# Altium schematic sheet ESCs_2S.SchDoc: Init Title in DocParam
size A3; Organization: Use Organization_Name in ProjParam; Address1: Daniel Burnier; Address2: STI-IMT-LSRO1; Address3: EPFL; Address4: CH-1015 LAUSANNE; DocumentNumber: Init DocumentNumber in DocParam; Revision: A; SheetNumber: 1; SheetTotal: 1; ApprovedBy: Init ApprovedBy in DocParam; CheckedBy: Init CheckedBy in DocParam; Author: Init Author in DocParam; CompanyName: Init CompanyName in DocParam; DrawnBy: Init DrawBy in DocParam; Engineer: Init Engineer in DocParam; Title2: Init Title2 in DocParam; DocumentName: Init DocumentName in DocParam; ProjectName: Init ProjectName in DocParam
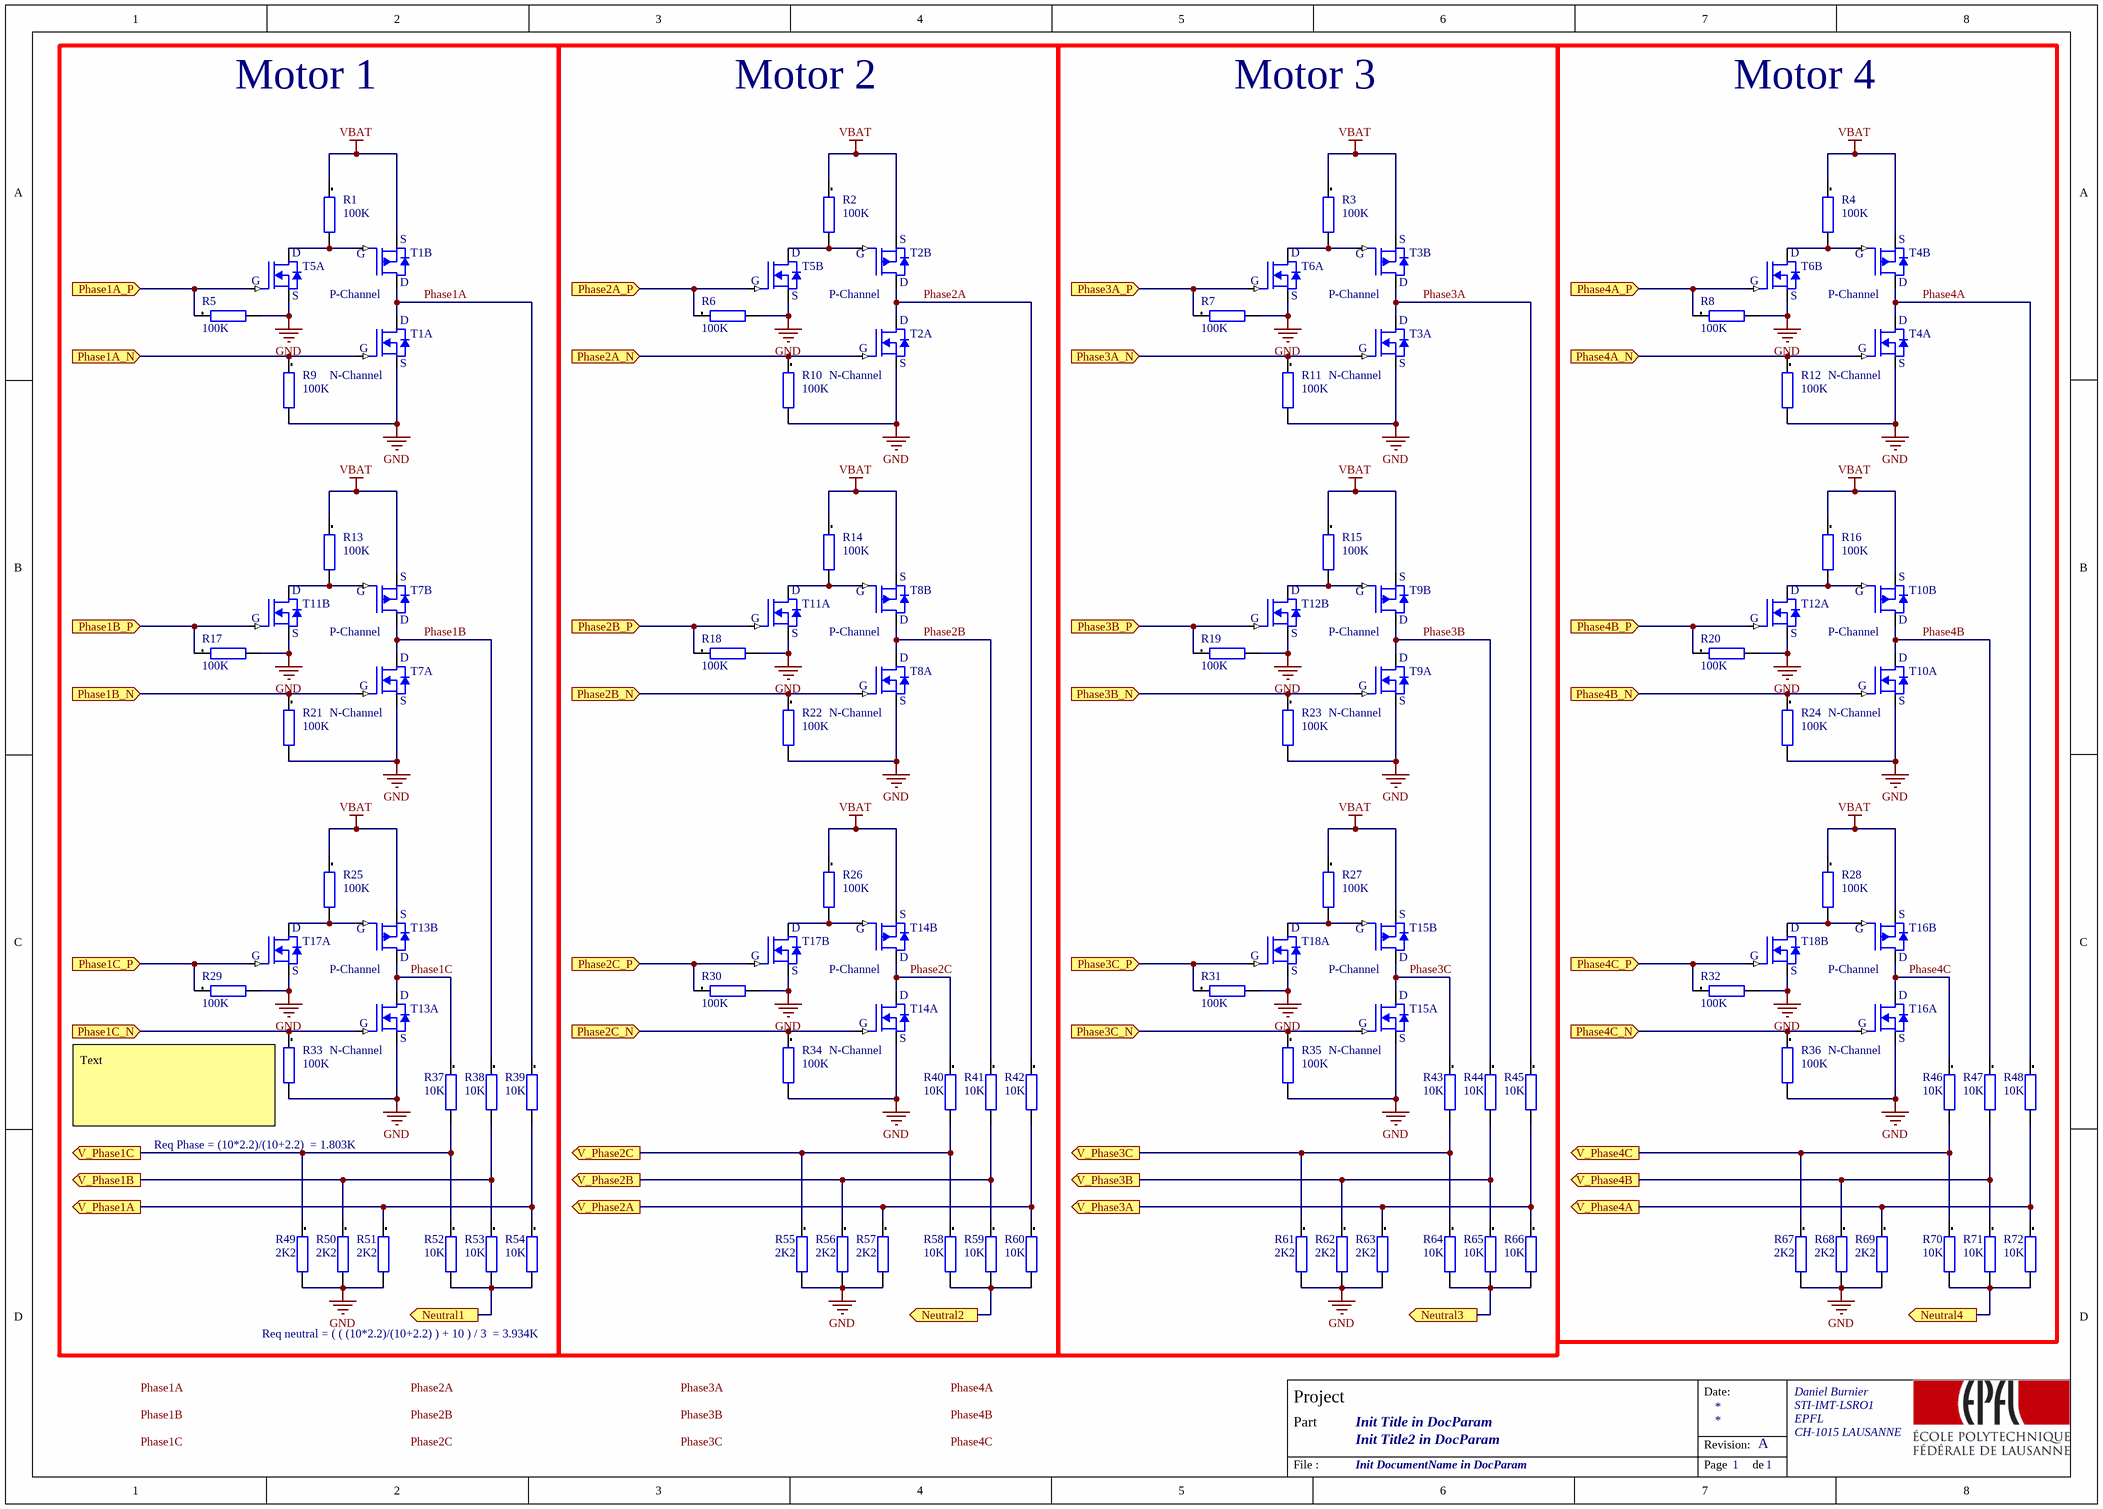
[diagram p0: ESCs_2S.SchDoc]

## Parts
R1  100K  [RESC0201(0603)_L]
R2  100K  [RESC0201(0603)_L]
R3  100K  [RESC0201(0603)_L]
R4  100K  [RESC0201(0603)_L]
R5  100K  [RESC0201(0603)_L]
R6  100K  [RESC0201(0603)_L]
R7  100K  [RESC0201(0603)_L]
R8  100K  [RESC0201(0603)_L]
R9  100K  [RESC0201(0603)_L]
R10  100K  [RESC0201(0603)_L]
R11  100K  [RESC0201(0603)_L]
R12  100K  [RESC0201(0603)_L]
R13  100K  [RESC0201(0603)_L]
R14  100K  [RESC0201(0603)_L]
R15  100K  [RESC0201(0603)_L]
R16  100K  [RESC0201(0603)_L]
R17  100K  [RESC0201(0603)_L]
R18  100K  [RESC0201(0603)_L]
R19  100K  [RESC0201(0603)_L]
R20  100K  [RESC0201(0603)_L]
R21  100K  [RESC0201(0603)_L]
R22  100K  [RESC0201(0603)_L]
R23  100K  [RESC0201(0603)_L]
R24  100K  [RESC0201(0603)_L]
R25  100K  [RESC0201(0603)_L]
R26  100K  [RESC0201(0603)_L]
R27  100K  [RESC0201(0603)_L]
R28  100K  [RESC0201(0603)_L]
R29  100K  [RESC0201(0603)_L]
R30  100K  [RESC0201(0603)_L]
R31  100K  [RESC0201(0603)_L]
R32  100K  [RESC0201(0603)_L]
R33  100K  [RESC0201(0603)_L]
R34  100K  [RESC0201(0603)_L]
R35  100K  [RESC0201(0603)_L]
R36  100K  [RESC0201(0603)_L]
R37  10K  [RESC0201(0603)_L]
R38  10K  [RESC0201(0603)_L]
R39  10K  [RESC0201(0603)_L]
R40  10K  [RESC0201(0603)_L]
R41  10K  [RESC0201(0603)_L]
R42  10K  [RESC0201(0603)_L]
R43  10K  [RESC0201(0603)_L]
R44  10K  [RESC0201(0603)_L]
R45  10K  [RESC0201(0603)_L]
R46  10K  [RESC0201(0603)_L]
R47  10K  [RESC0201(0603)_L]
R48  10K  [RESC0201(0603)_L]
R49  2K2  [RESC0201(0603)_L]
R50  2K2  [RESC0201(0603)_L]
R51  2K2  [RESC0201(0603)_L]
R52  10K  [RESC0201(0603)_L]
R53  10K  [RESC0201(0603)_L]
R54  10K  [RESC0201(0603)_L]
R55  2K2  [RESC0201(0603)_L]
R56  2K2  [RESC0201(0603)_L]
R57  2K2  [RESC0201(0603)_L]
R58  10K  [RESC0201(0603)_L]
R59  10K  [RESC0201(0603)_L]
R60  10K  [RESC0201(0603)_L]
R61  2K2  [RESC0201(0603)_L]
R62  2K2  [RESC0201(0603)_L]
R63  2K2  [RESC0201(0603)_L]
R64  10K  [RESC0201(0603)_L]
R65  10K  [RESC0201(0603)_L]
R66  10K  [RESC0201(0603)_L]
R67  2K2  [RESC0201(0603)_L]
R68  2K2  [RESC0201(0603)_L]
R69  2K2  [RESC0201(0603)_L]
R70  10K  [RESC0201(0603)_L]
R71  10K  [RESC0201(0603)_L]
R72  10K  [RESC0201(0603)_L]
T1  ECH8668-TL-H  [8-SMD Flat lead]  (value not drawn)  (parts A,B of 2)
T2  ECH8668-TL-H  [8-SMD Flat lead]  (value not drawn)  (parts A,B of 2)
T3  ECH8668-TL-H  [8-SMD Flat lead]  (value not drawn)  (parts A,B of 2)
T4  ECH8668-TL-H  [8-SMD Flat lead]  (value not drawn)  (parts A,B of 2)
T5  PMDXB550UNEZ  [DFN1010B-6]  (value not drawn)  (parts A,B of 2)
T6  PMDXB550UNEZ  [DFN1010B-6]  (value not drawn)  (parts A,B of 2)
T7  ECH8668-TL-H  [8-SMD Flat lead]  (value not drawn)  (parts A,B of 2)
T8  ECH8668-TL-H  [8-SMD Flat lead]  (value not drawn)  (parts A,B of 2)
T9  ECH8668-TL-H  [8-SMD Flat lead]  (value not drawn)  (parts A,B of 2)
T10  ECH8668-TL-H  [8-SMD Flat lead]  (value not drawn)  (parts A,B of 2)
T11  PMDXB550UNEZ  [DFN1010B-6]  (value not drawn)  (parts A,B of 2)
T12  PMDXB550UNEZ  [DFN1010B-6]  (value not drawn)  (parts A,B of 2)
T13  ECH8668-TL-H  [8-SMD Flat lead]  (value not drawn)  (parts A,B of 2)
T14  ECH8668-TL-H  [8-SMD Flat lead]  (value not drawn)  (parts A,B of 2)
T15  ECH8668-TL-H  [8-SMD Flat lead]  (value not drawn)  (parts A,B of 2)
T16  ECH8668-TL-H  [8-SMD Flat lead]  (value not drawn)  (parts A,B of 2)
T17  PMDXB550UNEZ  [DFN1010B-6]  (value not drawn)  (parts A,B of 2)
T18  PMDXB550UNEZ  [DFN1010B-6]  (value not drawn)  (parts A,B of 2)

## Blocks framed on the sheet
Motor 1: R1 R5 R9 R13 R17 R21 R25 R29 R33 R37-R39 R49-R54 T1 T5 T7 T11 T13 T17
Motor 2: R2 R6 R10 R14 R18 R22 R26 R30 R34 R40-R42 R55-R60 T2 T5 T8 T11 T14 T17
Motor 3: R3 R7 R11 R15 R19 R23 R27 R31 R35 R43-R45 R61-R66 T3 T6 T9 T12 T15 T18
Motor 4: R4 R8 R12 R16 R20 R24 R28 R32 R36 R46-R48 R67-R72 T4 T6 T10 T12 T16 T18

## Ports
Neutral1 (out), Neutral2 (out), Neutral3 (out), Neutral4 (out), Phase1A_N (in), Phase1A_P (in), Phase1B_N (in), Phase1B_P (in), Phase1C_N (in), Phase1C_P (in), Phase2A_N (in), Phase2A_P (in), Phase2B_N (in), Phase2B_P (in), Phase2C_N (in), Phase2C_P (in), Phase3A_N (in), Phase3A_P (in), Phase3B_N (in), Phase3B_P (in), Phase3C_N (in), Phase3C_P (in), Phase4A_N (in), Phase4A_P (in), Phase4B_N (in), Phase4B_P (in), Phase4C_N (in), Phase4C_P (in), V_Phase1A (out), V_Phase1B (out), V_Phase1C (out), V_Phase2A (out), V_Phase2B (out), V_Phase2C (out), V_Phase3A (out), V_Phase3B (out), V_Phase3C (out), V_Phase4A (out), V_Phase4B (out), V_Phase4C (out)

## Nets
GND: R5.2 R6.2 R7.2 R8.2 R9.2 R10.2 R11.2 R12.2 R17.2 R18.2 R19.2 R20.2 R21.2 R22.2 R23.2 R24.2 R29.2 R30.2 R31.2 R32.2 R33.2 R34.2 R35.2 R36.2 R49.2 R50.2 R51.2 R55.2 R56.2 R57.2 R61.2 R62.2 R63.2 R67.2 R68.2 R69.2 T1.1(S) T2.1(S) T3.1(S) T4.1(S) T5.1(S) T5.4(S) T6.1(S) T6.4(S) T7.1(S) T8.1(S) T9.1(S) T10.1(S) T11.1(S) T11.4(S) T12.1(S) T12.4(S) T13.1(S) T14.1(S) T15.1(S) T16.1(S) T17.1(S) T17.4(S) T18.1(S) T18.4(S)
VBAT: R1.1 R2.1 R3.1 R4.1 R13.1 R14.1 R15.1 R16.1 R25.1 R26.1 R27.1 R28.1 T1.3(S) T2.3(S) T3.3(S) T4.3(S) T7.3(S) T8.3(S) T9.3(S) T10.3(S) T13.3(S) T14.3(S) T15.3(S) T16.3(S)
Neutral1: R52.2 R53.2 R54.2 ; port Neutral1
Neutral2: R58.2 R59.2 R60.2 ; port Neutral2
Neutral3: R64.2 R65.2 R66.2 ; port Neutral3
Neutral4: R70.2 R71.2 R72.2 ; port Neutral4
Phase1A: R39.1 T1.5(D) T1.6(D)
Phase1A_N: R9.1 T1.2(G) ; port Phase1A_N
Phase1A_P: R5.1 T5.2(G) ; port Phase1A_P
Phase1B: R38.1 T7.5(D) T7.6(D)
Phase1B_N: R21.1 T7.2(G) ; port Phase1B_N
Phase1B_P: R17.1 T11.5(G) ; port Phase1B_P
Phase1C: R37.1 T13.5(D) T13.6(D)
Phase1C_N: R33.1 T13.2(G) ; port Phase1C_N
Phase1C_P: R29.1 T17.2(G) ; port Phase1C_P
Phase2A: R42.1 T2.5(D) T2.6(D)
Phase2A_N: R10.1 T2.2(G) ; port Phase2A_N
Phase2A_P: R6.1 T5.5(G) ; port Phase2A_P
Phase2B: R41.1 T8.5(D) T8.6(D)
Phase2B_N: R22.1 T8.2(G) ; port Phase2B_N
Phase2B_P: R18.1 T11.2(G) ; port Phase2B_P
Phase2C: R40.1 T14.5(D) T14.6(D)
Phase2C_N: R34.1 T14.2(G) ; port Phase2C_N
Phase2C_P: R30.1 T17.5(G) ; port Phase2C_P
Phase3A: R45.1 T3.5(D) T3.6(D)
Phase3A_N: R11.1 T3.2(G) ; port Phase3A_N
Phase3A_P: R7.1 T6.2(G) ; port Phase3A_P
Phase3B: R44.1 T9.5(D) T9.6(D)
Phase3B_N: R23.1 T9.2(G) ; port Phase3B_N
Phase3B_P: R19.1 T12.5(G) ; port Phase3B_P
Phase3C: R43.1 T15.5(D) T15.6(D)
Phase3C_N: R35.1 T15.2(G) ; port Phase3C_N
Phase3C_P: R31.1 T18.2(G) ; port Phase3C_P
Phase4A: R48.1 T4.5(D) T4.6(D)
Phase4A_N: R12.1 T4.2(G) ; port Phase4A_N
Phase4A_P: R8.1 T6.5(G) ; port Phase4A_P
Phase4B: R47.1 T10.5(D) T10.6(D)
Phase4B_N: R24.1 T10.2(G) ; port Phase4B_N
Phase4B_P: R20.1 T12.2(G) ; port Phase4B_P
Phase4C: R46.1 T16.5(D) T16.6(D)
Phase4C_N: R36.1 T16.2(G) ; port Phase4C_N
Phase4C_P: R32.1 T18.5(G) ; port Phase4C_P
V_Phase1A: R39.2 R51.1 R54.1 ; port V_Phase1A
V_Phase1B: R38.2 R50.1 R53.1 ; port V_Phase1B
V_Phase1C: R37.2 R49.1 R52.1 ; port V_Phase1C
V_Phase2A: R42.2 R57.1 R60.1 ; port V_Phase2A
V_Phase2B: R41.2 R56.1 R59.1 ; port V_Phase2B
V_Phase2C: R40.2 R55.1 R58.1 ; port V_Phase2C
V_Phase3A: R45.2 R63.1 R66.1 ; port V_Phase3A
V_Phase3B: R44.2 R62.1 R65.1 ; port V_Phase3B
V_Phase3C: R43.2 R61.1 R64.1 ; port V_Phase3C
V_Phase4A: R48.2 R69.1 R72.1 ; port V_Phase4A
V_Phase4B: R47.2 R68.1 R71.1 ; port V_Phase4B
V_Phase4C: R46.2 R67.1 R70.1 ; port V_Phase4C
NetR1_2: R1.2 T1.4(G) T5.6(D)
NetR2_2: R2.2 T2.4(G) T5.3(D)
NetR3_2: R3.2 T3.4(G) T6.6(D)
NetR4_2: R4.2 T4.4(G) T6.3(D)
NetR13_2: R13.2 T7.4(G) T11.3(D)
NetR14_2: R14.2 T8.4(G) T11.6(D)
NetR15_2: R15.2 T9.4(G) T12.3(D)
NetR16_2: R16.2 T10.4(G) T12.6(D)
NetR25_2: R25.2 T13.4(G) T17.6(D)
NetR26_2: R26.2 T14.4(G) T17.3(D)
NetR27_2: R27.2 T15.4(G) T18.6(D)
NetR28_2: R28.2 T16.4(G) T18.3(D)

## Notes on the sheet
- (near R33) Text
- Req Phase = (10*2.2)/(10+2.2)  = 1.803K
- Req neutral = ( ( (10*2.2)/(10+2.2) ) + 10 ) / 3  = 3.934K
- Labels drawn without touching a wire or pin: Phase1A, Phase1B, Phase1C, Phase2A, Phase2B, Phase2C, Phase3A, Phase3B, Phase3C, Phase4A, Phase4B, Phase4C
- Date:
- Project
- Part
- Revision:
- File :
- Page
- de
- (in symbol ECH8668-TL-H, part A) N-Channel
- (in symbol ECH8668-TL-H, part B) P-Channel

## Library data of the parts
R1-R72 = TBD[[/\]]0201[[/\]]1: Resistor ToDo 0201; Preference: 1; Currentie: CHF; Size: 0201; Footprint Acort: 0201; ROHS: True; DateLastUpdate: 2018-10-19 / 9:06:49 AM
T1-T4 T7-T10 T13-T16 = ECH8668-TL-H: MOSFET N/P-CH 20V 7.5A/5A ECH8; Manufacturer: ON Semiconductor; FET Type: N and P-Channel; FET Feature: Logic Level Gate; Current - Continuous Drain (Id) @ 25°C: 7.5A, 5A; Rds On (Max) @ Id, Vgs: 17 mOhm @ 4A, 4.5V; Gate Charge (Qg) (Max) @ Vgs: 10.8nC @ 4.5V; Input Capacitance (Ciss) (Max) @ Vds: 1060pF @ 10V; Power - Max: 1.5W; Supplier 1: Digi-Key; Manufacturer Part Number: ECH8668-TL-H; RoHS: RoHS Compliant; Category: Discrete Semiconductor Products; Stock 1: 3111; Pricing 1: 1=0.93, 10=0.811, 100=0.6259, 500=0.46362, 1000=0.37089 (USD); Packaging: Cut Tape (CT); Part Status: Active; Drain to Source Voltage (Vdss): 20V; Vgs(th) (Max) @ Id: -; Operating Temperature: 150°C (TJ); Mounting Type: Surface Mount; Package / Case: 8-SMD, Flat Lead; Supplier Device Package: 8-ECH; ComponentLink1URL: http://www.onsemi.com/pub/Collateral/ECH8668-D.PDF; ComponentLink1Description: http://www.onsemi.com/pub/Collateral/ECH8668-D.PDF; Supplier Part Number 1: ECH8668-TL-HOSCT-ND
T5 T6 T11 T12 T17 T18 = PMDXB550UNEZ: DUAL N-CHANNEL 30V; Manufacturer: NXP Semiconductors; Continuous Drain Current (ID): 590mA; Max Power Dissipation: 285mW; Rds On Max: 670mR; Input Capacitance: 30.3pF; FET Type: 2 N-Channel; Supplier 1: Digi-Key; Stock 1: 5582; Pricing 1: 1=0.48, 10=0.379, 100=0.2601, 500=0.17838, 1000=0.13379 (USD); Mount: Surface Mount; Min Operating Temperature: -55°C; Max Operating Temperature: 150°C; Drain to Source Voltage (Vdss): 30V; Packaging: Tape and Reel; Supplier Part Number 1: 1727-2277-1-ND; Manufacturer Part Number: PMDXB550UNEZ